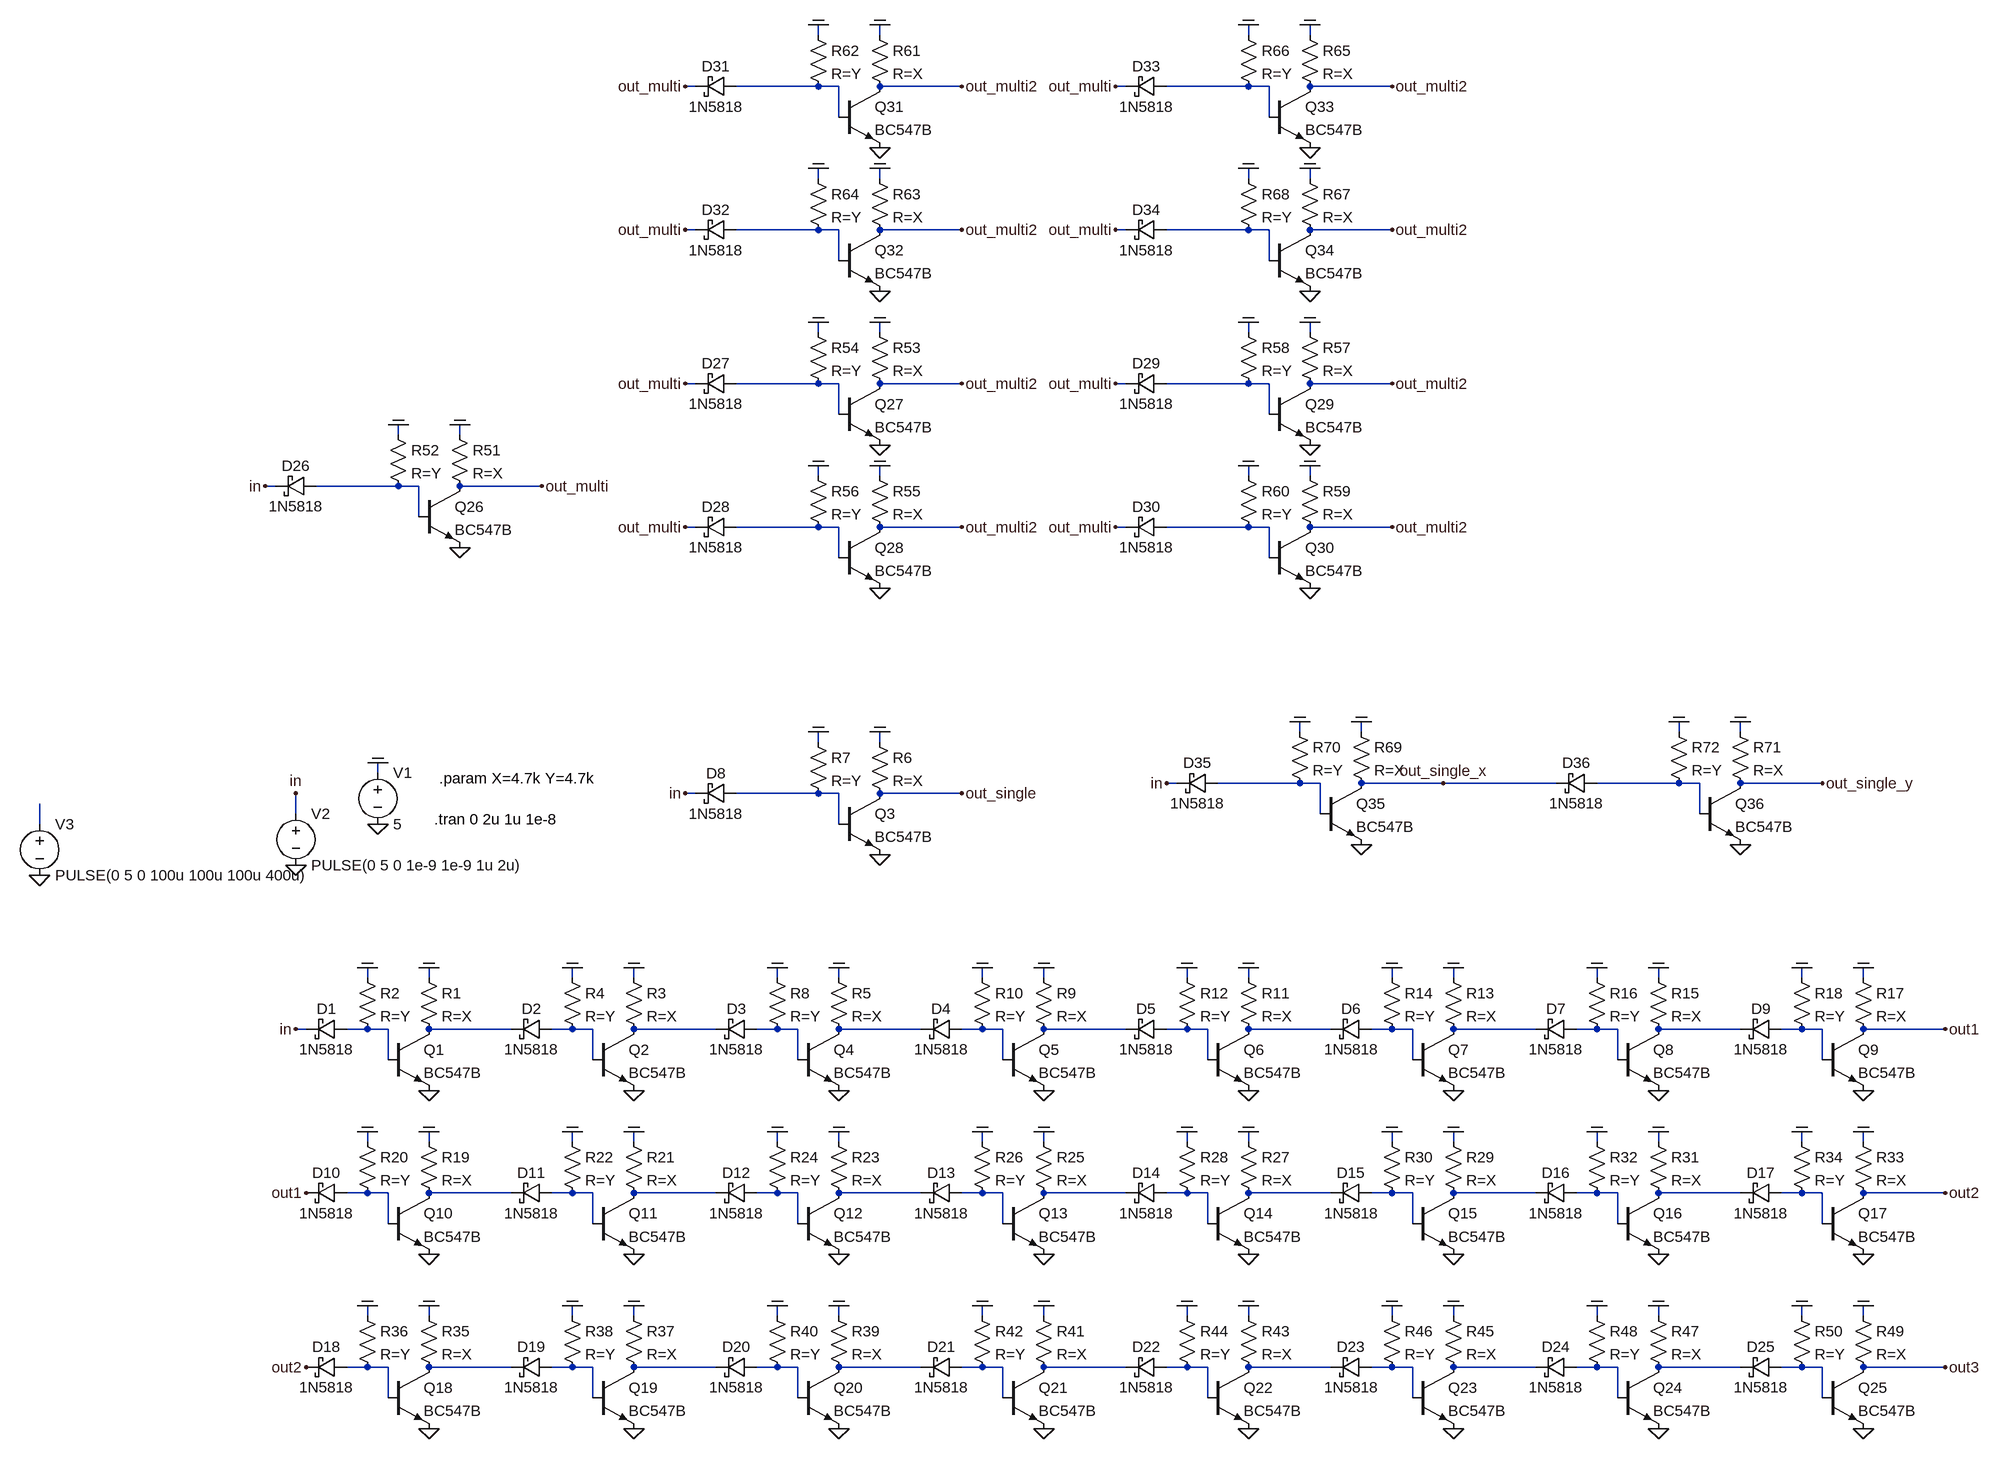
[diagram p0: schematic dtl_schottky.asc]
dtl_schottky.asc, the LTspice schematic file:
Version 4
SHEET 1 2948 1332
WIRE 576 -864 576 -880
WIRE 672 -864 672 -880
WIRE 1248 -864 1248 -880
WIRE 1344 -864 1344 -880
WIRE 384 -784 368 -784
WIRE 576 -784 448 -784
WIRE 608 -784 576 -784
WIRE 800 -784 672 -784
WIRE 1056 -784 1040 -784
WIRE 1248 -784 1120 -784
WIRE 1280 -784 1248 -784
WIRE 1472 -784 1344 -784
WIRE 608 -736 608 -784
WIRE 1280 -736 1280 -784
WIRE 576 -640 576 -656
WIRE 672 -640 672 -656
WIRE 1248 -640 1248 -656
WIRE 1344 -640 1344 -656
WIRE 384 -560 368 -560
WIRE 576 -560 448 -560
WIRE 608 -560 576 -560
WIRE 800 -560 672 -560
WIRE 1056 -560 1040 -560
WIRE 1248 -560 1120 -560
WIRE 1280 -560 1248 -560
WIRE 1472 -560 1344 -560
WIRE 608 -512 608 -560
WIRE 1280 -512 1280 -560
WIRE 576 -400 576 -416
WIRE 672 -400 672 -416
WIRE 1248 -400 1248 -416
WIRE 1344 -400 1344 -416
WIRE 384 -320 368 -320
WIRE 576 -320 448 -320
WIRE 608 -320 576 -320
WIRE 800 -320 672 -320
WIRE 1056 -320 1040 -320
WIRE 1248 -320 1120 -320
WIRE 1280 -320 1248 -320
WIRE 1472 -320 1344 -320
WIRE 608 -272 608 -320
WIRE 1280 -272 1280 -320
WIRE -80 -240 -80 -256
WIRE 16 -240 16 -256
WIRE 576 -176 576 -192
WIRE 672 -176 672 -192
WIRE 1248 -176 1248 -192
WIRE 1344 -176 1344 -192
WIRE -272 -160 -288 -160
WIRE -80 -160 -208 -160
WIRE -48 -160 -80 -160
WIRE 144 -160 16 -160
WIRE -48 -112 -48 -160
WIRE 384 -96 368 -96
WIRE 576 -96 448 -96
WIRE 608 -96 576 -96
WIRE 800 -96 672 -96
WIRE 1056 -96 1040 -96
WIRE 1248 -96 1120 -96
WIRE 1280 -96 1248 -96
WIRE 1472 -96 1344 -96
WIRE 608 -48 608 -96
WIRE 1280 -48 1280 -96
WIRE 1328 224 1328 208
WIRE 1424 224 1424 208
WIRE 1920 224 1920 208
WIRE 2016 224 2016 208
WIRE 576 240 576 224
WIRE 672 240 672 224
WIRE -112 288 -112 272
WIRE 1136 304 1120 304
WIRE 1328 304 1200 304
WIRE 1360 304 1328 304
WIRE 1552 304 1424 304
WIRE 1728 304 1552 304
WIRE 1920 304 1792 304
WIRE 1952 304 1920 304
WIRE 2144 304 2016 304
WIRE 384 320 368 320
WIRE 576 320 448 320
WIRE 608 320 576 320
WIRE 800 320 672 320
WIRE -240 352 -240 320
WIRE 1360 352 1360 304
WIRE 1952 352 1952 304
WIRE -640 368 -640 336
WIRE 608 368 608 320
WIRE -128 608 -128 592
WIRE -32 608 -32 592
WIRE 192 608 192 592
WIRE 288 608 288 592
WIRE 512 608 512 592
WIRE 608 608 608 592
WIRE 832 608 832 592
WIRE 928 608 928 592
WIRE 1152 608 1152 592
WIRE 1248 608 1248 592
WIRE 1472 608 1472 592
WIRE 1568 608 1568 592
WIRE 1792 608 1792 592
WIRE 1888 608 1888 592
WIRE 2112 608 2112 592
WIRE 2208 608 2208 592
WIRE -224 688 -240 688
WIRE -128 688 -160 688
WIRE -96 688 -128 688
WIRE 96 688 -32 688
WIRE 192 688 160 688
WIRE 224 688 192 688
WIRE 416 688 288 688
WIRE 512 688 480 688
WIRE 544 688 512 688
WIRE 736 688 608 688
WIRE 832 688 800 688
WIRE 864 688 832 688
WIRE 1056 688 928 688
WIRE 1152 688 1120 688
WIRE 1184 688 1152 688
WIRE 1376 688 1248 688
WIRE 1472 688 1440 688
WIRE 1504 688 1472 688
WIRE 1696 688 1568 688
WIRE 1792 688 1760 688
WIRE 1824 688 1792 688
WIRE 2016 688 1888 688
WIRE 2112 688 2080 688
WIRE 2144 688 2112 688
WIRE 2336 688 2208 688
WIRE -96 736 -96 688
WIRE 224 736 224 688
WIRE 544 736 544 688
WIRE 864 736 864 688
WIRE 1184 736 1184 688
WIRE 1504 736 1504 688
WIRE 1824 736 1824 688
WIRE 2144 736 2144 688
WIRE -128 864 -128 848
WIRE -32 864 -32 848
WIRE 192 864 192 848
WIRE 288 864 288 848
WIRE 512 864 512 848
WIRE 608 864 608 848
WIRE 832 864 832 848
WIRE 928 864 928 848
WIRE 1152 864 1152 848
WIRE 1248 864 1248 848
WIRE 1472 864 1472 848
WIRE 1568 864 1568 848
WIRE 1792 864 1792 848
WIRE 1888 864 1888 848
WIRE 2112 864 2112 848
WIRE 2208 864 2208 848
WIRE -128 944 -160 944
WIRE -96 944 -128 944
WIRE 96 944 -32 944
WIRE 192 944 160 944
WIRE 224 944 192 944
WIRE 416 944 288 944
WIRE 512 944 480 944
WIRE 544 944 512 944
WIRE 736 944 608 944
WIRE 832 944 800 944
WIRE 864 944 832 944
WIRE 1056 944 928 944
WIRE 1152 944 1120 944
WIRE 1184 944 1152 944
WIRE 1376 944 1248 944
WIRE 1472 944 1440 944
WIRE 1504 944 1472 944
WIRE 1696 944 1568 944
WIRE 1792 944 1760 944
WIRE 1824 944 1792 944
WIRE 2016 944 1888 944
WIRE 2112 944 2080 944
WIRE 2144 944 2112 944
WIRE 2336 944 2208 944
WIRE -96 992 -96 944
WIRE 224 992 224 944
WIRE 544 992 544 944
WIRE 864 992 864 944
WIRE 1184 992 1184 944
WIRE 1504 992 1504 944
WIRE 1824 992 1824 944
WIRE 2144 992 2144 944
WIRE -128 1136 -128 1120
WIRE -32 1136 -32 1120
WIRE 192 1136 192 1120
WIRE 288 1136 288 1120
WIRE 512 1136 512 1120
WIRE 608 1136 608 1120
WIRE 832 1136 832 1120
WIRE 928 1136 928 1120
WIRE 1152 1136 1152 1120
WIRE 1248 1136 1248 1120
WIRE 1472 1136 1472 1120
WIRE 1568 1136 1568 1120
WIRE 1792 1136 1792 1120
WIRE 1888 1136 1888 1120
WIRE 2112 1136 2112 1120
WIRE 2208 1136 2208 1120
WIRE -128 1216 -160 1216
WIRE -96 1216 -128 1216
WIRE 96 1216 -32 1216
WIRE 192 1216 160 1216
WIRE 224 1216 192 1216
WIRE 416 1216 288 1216
WIRE 512 1216 480 1216
WIRE 544 1216 512 1216
WIRE 736 1216 608 1216
WIRE 832 1216 800 1216
WIRE 864 1216 832 1216
WIRE 1056 1216 928 1216
WIRE 1152 1216 1120 1216
WIRE 1184 1216 1152 1216
WIRE 1376 1216 1248 1216
WIRE 1472 1216 1440 1216
WIRE 1504 1216 1472 1216
WIRE 1696 1216 1568 1216
WIRE 1792 1216 1760 1216
WIRE 1824 1216 1792 1216
WIRE 2016 1216 1888 1216
WIRE 2112 1216 2080 1216
WIRE 2144 1216 2112 1216
WIRE 2336 1216 2208 1216
WIRE -96 1264 -96 1216
WIRE 224 1264 224 1216
WIRE 544 1264 544 1216
WIRE 864 1264 864 1216
WIRE 1184 1264 1184 1216
WIRE 1504 1264 1504 1216
WIRE 1824 1264 1824 1216
WIRE 2144 1264 2144 1216
FLAG -112 368 0
FLAG -112 272 COM
FLAG -240 432 0
FLAG 672 416 0
FLAG 672 224 COM
FLAG 576 224 COM
FLAG 368 320 in
FLAG 800 320 out_single
FLAG -32 784 0
FLAG -32 592 COM
FLAG -128 592 COM
FLAG -240 688 in
FLAG 288 784 0
FLAG 288 592 COM
FLAG 192 592 COM
FLAG 608 784 0
FLAG 608 592 COM
FLAG 512 592 COM
FLAG 928 784 0
FLAG 928 592 COM
FLAG 832 592 COM
FLAG 1248 784 0
FLAG 1248 592 COM
FLAG 1152 592 COM
FLAG 1568 784 0
FLAG 1568 592 COM
FLAG 1472 592 COM
FLAG 1888 784 0
FLAG 1888 592 COM
FLAG 1792 592 COM
FLAG 2208 784 0
FLAG 2208 592 COM
FLAG 2112 592 COM
FLAG -32 1040 0
FLAG -32 848 COM
FLAG -128 848 COM
FLAG 288 1040 0
FLAG 288 848 COM
FLAG 192 848 COM
FLAG 608 1040 0
FLAG 608 848 COM
FLAG 512 848 COM
FLAG 928 1040 0
FLAG 928 848 COM
FLAG 832 848 COM
FLAG 1248 1040 0
FLAG 1248 848 COM
FLAG 1152 848 COM
FLAG 1568 1040 0
FLAG 1568 848 COM
FLAG 1472 848 COM
FLAG 1888 1040 0
FLAG 1888 848 COM
FLAG 1792 848 COM
FLAG 2208 1040 0
FLAG 2208 848 COM
FLAG 2112 848 COM
FLAG -32 1312 0
FLAG -32 1120 COM
FLAG -128 1120 COM
FLAG 288 1312 0
FLAG 288 1120 COM
FLAG 192 1120 COM
FLAG 608 1312 0
FLAG 608 1120 COM
FLAG 512 1120 COM
FLAG 928 1312 0
FLAG 928 1120 COM
FLAG 832 1120 COM
FLAG 1248 1312 0
FLAG 1248 1120 COM
FLAG 1152 1120 COM
FLAG 1568 1312 0
FLAG 1568 1120 COM
FLAG 1472 1120 COM
FLAG 1888 1312 0
FLAG 1888 1120 COM
FLAG 1792 1120 COM
FLAG 2208 1312 0
FLAG 2208 1120 COM
FLAG 2112 1120 COM
FLAG 2336 688 out1
FLAG -224 944 out1
FLAG 2336 944 out2
FLAG -224 1216 out2
FLAG 2336 1216 out3
FLAG 16 -64 0
FLAG 16 -256 COM
FLAG -80 -256 COM
FLAG -288 -160 in
FLAG 144 -160 out_multi
FLAG 672 -224 0
FLAG 672 -416 COM
FLAG 576 -416 COM
FLAG 368 -320 out_multi
FLAG 800 -320 out_multi2
FLAG 672 0 0
FLAG 672 -192 COM
FLAG 576 -192 COM
FLAG 368 -96 out_multi
FLAG 800 -96 out_multi2
FLAG 1344 -224 0
FLAG 1344 -416 COM
FLAG 1248 -416 COM
FLAG 1040 -320 out_multi
FLAG 1472 -320 out_multi2
FLAG 1344 0 0
FLAG 1344 -192 COM
FLAG 1248 -192 COM
FLAG 1040 -96 out_multi
FLAG 1472 -96 out_multi2
FLAG 672 -688 0
FLAG 672 -880 COM
FLAG 576 -880 COM
FLAG 368 -784 out_multi
FLAG 800 -784 out_multi2
FLAG 672 -464 0
FLAG 672 -656 COM
FLAG 576 -656 COM
FLAG 368 -560 out_multi
FLAG 800 -560 out_multi2
FLAG 1344 -688 0
FLAG 1344 -880 COM
FLAG 1248 -880 COM
FLAG 1040 -784 out_multi
FLAG 1472 -784 out_multi2
FLAG 1344 -464 0
FLAG 1344 -656 COM
FLAG 1248 -656 COM
FLAG 1040 -560 out_multi
FLAG 1472 -560 out_multi2
FLAG 1424 400 0
FLAG 1424 208 COM
FLAG 1328 208 COM
FLAG 1120 304 in
FLAG 2016 400 0
FLAG 2016 208 COM
FLAG 1920 208 COM
FLAG 1552 304 out_single_x
FLAG 2144 304 out_single_y
FLAG -640 448 0
FLAG -240 320 in
SYMBOL voltage -112 272 R0
WINDOW 123 0 0 Left 2
WINDOW 39 0 0 Left 2
SYMATTR InstName V1
SYMATTR Value 5
SYMBOL voltage -240 336 R0
WINDOW 123 0 0 Left 2
WINDOW 39 0 0 Left 2
SYMATTR InstName V2
SYMATTR Value PULSE(0 5 0 1e-9 1e-9 1u 2u)
SYMBOL npn 608 320 R0
SYMATTR InstName Q3
SYMATTR Value BC547B
SYMBOL res 656 224 R0
SYMATTR InstName R6
SYMATTR Value R=X
SYMBOL schottky 448 304 R90
WINDOW 0 0 32 VBottom 2
WINDOW 3 32 32 VTop 2
SYMATTR InstName D8
SYMATTR Value 1N5818
SYMATTR Description Diode
SYMATTR Type diode
SYMBOL res 560 224 R0
SYMATTR InstName R7
SYMATTR Value R=Y
SYMBOL npn -96 688 R0
SYMATTR InstName Q1
SYMATTR Value BC547B
SYMBOL res -48 592 R0
SYMATTR InstName R1
SYMATTR Value R=X
SYMBOL schottky -160 672 R90
WINDOW 0 0 32 VBottom 2
WINDOW 3 32 32 VTop 2
SYMATTR InstName D1
SYMATTR Value 1N5818
SYMATTR Description Diode
SYMATTR Type diode
SYMBOL res -144 592 R0
SYMATTR InstName R2
SYMATTR Value R=Y
SYMBOL npn 224 688 R0
SYMATTR InstName Q2
SYMATTR Value BC547B
SYMBOL res 272 592 R0
SYMATTR InstName R3
SYMATTR Value R=X
SYMBOL schottky 160 672 R90
WINDOW 0 0 32 VBottom 2
WINDOW 3 32 32 VTop 2
SYMATTR InstName D2
SYMATTR Value 1N5818
SYMATTR Description Diode
SYMATTR Type diode
SYMBOL res 176 592 R0
SYMATTR InstName R4
SYMATTR Value R=Y
SYMBOL npn 544 688 R0
SYMATTR InstName Q4
SYMATTR Value BC547B
SYMBOL res 592 592 R0
SYMATTR InstName R5
SYMATTR Value R=X
SYMBOL schottky 480 672 R90
WINDOW 0 0 32 VBottom 2
WINDOW 3 32 32 VTop 2
SYMATTR InstName D3
SYMATTR Value 1N5818
SYMATTR Description Diode
SYMATTR Type diode
SYMBOL res 496 592 R0
SYMATTR InstName R8
SYMATTR Value R=Y
SYMBOL npn 864 688 R0
SYMATTR InstName Q5
SYMATTR Value BC547B
SYMBOL res 912 592 R0
SYMATTR InstName R9
SYMATTR Value R=X
SYMBOL schottky 800 672 R90
WINDOW 0 0 32 VBottom 2
WINDOW 3 32 32 VTop 2
SYMATTR InstName D4
SYMATTR Value 1N5818
SYMATTR Description Diode
SYMATTR Type diode
SYMBOL res 816 592 R0
SYMATTR InstName R10
SYMATTR Value R=Y
SYMBOL npn 1184 688 R0
SYMATTR InstName Q6
SYMATTR Value BC547B
SYMBOL res 1232 592 R0
SYMATTR InstName R11
SYMATTR Value R=X
SYMBOL schottky 1120 672 R90
WINDOW 0 0 32 VBottom 2
WINDOW 3 32 32 VTop 2
SYMATTR InstName D5
SYMATTR Value 1N5818
SYMATTR Description Diode
SYMATTR Type diode
SYMBOL res 1136 592 R0
SYMATTR InstName R12
SYMATTR Value R=Y
SYMBOL npn 1504 688 R0
SYMATTR InstName Q7
SYMATTR Value BC547B
SYMBOL res 1552 592 R0
SYMATTR InstName R13
SYMATTR Value R=X
SYMBOL schottky 1440 672 R90
WINDOW 0 0 32 VBottom 2
WINDOW 3 32 32 VTop 2
SYMATTR InstName D6
SYMATTR Value 1N5818
SYMATTR Description Diode
SYMATTR Type diode
SYMBOL res 1456 592 R0
SYMATTR InstName R14
SYMATTR Value R=Y
SYMBOL npn 1824 688 R0
SYMATTR InstName Q8
SYMATTR Value BC547B
SYMBOL res 1872 592 R0
SYMATTR InstName R15
SYMATTR Value R=X
SYMBOL schottky 1760 672 R90
WINDOW 0 0 32 VBottom 2
WINDOW 3 32 32 VTop 2
SYMATTR InstName D7
SYMATTR Value 1N5818
SYMATTR Description Diode
SYMATTR Type diode
SYMBOL res 1776 592 R0
SYMATTR InstName R16
SYMATTR Value R=Y
SYMBOL npn 2144 688 R0
SYMATTR InstName Q9
SYMATTR Value BC547B
SYMBOL res 2192 592 R0
SYMATTR InstName R17
SYMATTR Value R=X
SYMBOL schottky 2080 672 R90
WINDOW 0 0 32 VBottom 2
WINDOW 3 32 32 VTop 2
SYMATTR InstName D9
SYMATTR Value 1N5818
SYMATTR Description Diode
SYMATTR Type diode
SYMBOL res 2096 592 R0
SYMATTR InstName R18
SYMATTR Value R=Y
SYMBOL npn -96 944 R0
SYMATTR InstName Q10
SYMATTR Value BC547B
SYMBOL res -48 848 R0
SYMATTR InstName R19
SYMATTR Value R=X
SYMBOL schottky -160 928 R90
WINDOW 0 0 32 VBottom 2
WINDOW 3 32 32 VTop 2
SYMATTR InstName D10
SYMATTR Value 1N5818
SYMATTR Description Diode
SYMATTR Type diode
SYMBOL res -144 848 R0
SYMATTR InstName R20
SYMATTR Value R=Y
SYMBOL npn 224 944 R0
SYMATTR InstName Q11
SYMATTR Value BC547B
SYMBOL res 272 848 R0
SYMATTR InstName R21
SYMATTR Value R=X
SYMBOL schottky 160 928 R90
WINDOW 0 0 32 VBottom 2
WINDOW 3 32 32 VTop 2
SYMATTR InstName D11
SYMATTR Value 1N5818
SYMATTR Description Diode
SYMATTR Type diode
SYMBOL res 176 848 R0
SYMATTR InstName R22
SYMATTR Value R=Y
SYMBOL npn 544 944 R0
SYMATTR InstName Q12
SYMATTR Value BC547B
SYMBOL res 592 848 R0
SYMATTR InstName R23
SYMATTR Value R=X
SYMBOL schottky 480 928 R90
WINDOW 0 0 32 VBottom 2
WINDOW 3 32 32 VTop 2
SYMATTR InstName D12
SYMATTR Value 1N5818
SYMATTR Description Diode
SYMATTR Type diode
SYMBOL res 496 848 R0
SYMATTR InstName R24
SYMATTR Value R=Y
SYMBOL npn 864 944 R0
SYMATTR InstName Q13
SYMATTR Value BC547B
SYMBOL res 912 848 R0
SYMATTR InstName R25
SYMATTR Value R=X
SYMBOL schottky 800 928 R90
WINDOW 0 0 32 VBottom 2
WINDOW 3 32 32 VTop 2
SYMATTR InstName D13
SYMATTR Value 1N5818
SYMATTR Description Diode
SYMATTR Type diode
SYMBOL res 816 848 R0
SYMATTR InstName R26
SYMATTR Value R=Y
SYMBOL npn 1184 944 R0
SYMATTR InstName Q14
SYMATTR Value BC547B
SYMBOL res 1232 848 R0
SYMATTR InstName R27
SYMATTR Value R=X
SYMBOL schottky 1120 928 R90
WINDOW 0 0 32 VBottom 2
WINDOW 3 32 32 VTop 2
SYMATTR InstName D14
SYMATTR Value 1N5818
SYMATTR Description Diode
SYMATTR Type diode
SYMBOL res 1136 848 R0
SYMATTR InstName R28
SYMATTR Value R=Y
SYMBOL npn 1504 944 R0
SYMATTR InstName Q15
SYMATTR Value BC547B
SYMBOL res 1552 848 R0
SYMATTR InstName R29
SYMATTR Value R=X
SYMBOL schottky 1440 928 R90
WINDOW 0 0 32 VBottom 2
WINDOW 3 32 32 VTop 2
SYMATTR InstName D15
SYMATTR Value 1N5818
SYMATTR Description Diode
SYMATTR Type diode
SYMBOL res 1456 848 R0
SYMATTR InstName R30
SYMATTR Value R=Y
SYMBOL npn 1824 944 R0
SYMATTR InstName Q16
SYMATTR Value BC547B
SYMBOL res 1872 848 R0
SYMATTR InstName R31
SYMATTR Value R=X
SYMBOL schottky 1760 928 R90
WINDOW 0 0 32 VBottom 2
WINDOW 3 32 32 VTop 2
SYMATTR InstName D16
SYMATTR Value 1N5818
SYMATTR Description Diode
SYMATTR Type diode
SYMBOL res 1776 848 R0
SYMATTR InstName R32
SYMATTR Value R=Y
SYMBOL npn 2144 944 R0
SYMATTR InstName Q17
SYMATTR Value BC547B
SYMBOL res 2192 848 R0
SYMATTR InstName R33
SYMATTR Value R=X
SYMBOL schottky 2080 928 R90
WINDOW 0 0 32 VBottom 2
WINDOW 3 32 32 VTop 2
SYMATTR InstName D17
SYMATTR Value 1N5818
SYMATTR Description Diode
SYMATTR Type diode
SYMBOL res 2096 848 R0
SYMATTR InstName R34
SYMATTR Value R=Y
SYMBOL npn -96 1216 R0
SYMATTR InstName Q18
SYMATTR Value BC547B
SYMBOL res -48 1120 R0
SYMATTR InstName R35
SYMATTR Value R=X
SYMBOL schottky -160 1200 R90
WINDOW 0 0 32 VBottom 2
WINDOW 3 32 32 VTop 2
SYMATTR InstName D18
SYMATTR Value 1N5818
SYMATTR Description Diode
SYMATTR Type diode
SYMBOL res -144 1120 R0
SYMATTR InstName R36
SYMATTR Value R=Y
SYMBOL npn 224 1216 R0
SYMATTR InstName Q19
SYMATTR Value BC547B
SYMBOL res 272 1120 R0
SYMATTR InstName R37
SYMATTR Value R=X
SYMBOL schottky 160 1200 R90
WINDOW 0 0 32 VBottom 2
WINDOW 3 32 32 VTop 2
SYMATTR InstName D19
SYMATTR Value 1N5818
SYMATTR Description Diode
SYMATTR Type diode
SYMBOL res 176 1120 R0
SYMATTR InstName R38
SYMATTR Value R=Y
SYMBOL npn 544 1216 R0
SYMATTR InstName Q20
SYMATTR Value BC547B
SYMBOL res 592 1120 R0
SYMATTR InstName R39
SYMATTR Value R=X
SYMBOL schottky 480 1200 R90
WINDOW 0 0 32 VBottom 2
WINDOW 3 32 32 VTop 2
SYMATTR InstName D20
SYMATTR Value 1N5818
SYMATTR Description Diode
SYMATTR Type diode
SYMBOL res 496 1120 R0
SYMATTR InstName R40
SYMATTR Value R=Y
SYMBOL npn 864 1216 R0
SYMATTR InstName Q21
SYMATTR Value BC547B
SYMBOL res 912 1120 R0
SYMATTR InstName R41
SYMATTR Value R=X
SYMBOL schottky 800 1200 R90
WINDOW 0 0 32 VBottom 2
WINDOW 3 32 32 VTop 2
SYMATTR InstName D21
SYMATTR Value 1N5818
SYMATTR Description Diode
SYMATTR Type diode
SYMBOL res 816 1120 R0
SYMATTR InstName R42
SYMATTR Value R=Y
SYMBOL npn 1184 1216 R0
SYMATTR InstName Q22
SYMATTR Value BC547B
SYMBOL res 1232 1120 R0
SYMATTR InstName R43
SYMATTR Value R=X
SYMBOL schottky 1120 1200 R90
WINDOW 0 0 32 VBottom 2
WINDOW 3 32 32 VTop 2
SYMATTR InstName D22
SYMATTR Value 1N5818
SYMATTR Description Diode
SYMATTR Type diode
SYMBOL res 1136 1120 R0
SYMATTR InstName R44
SYMATTR Value R=Y
SYMBOL npn 1504 1216 R0
SYMATTR InstName Q23
SYMATTR Value BC547B
SYMBOL res 1552 1120 R0
SYMATTR InstName R45
SYMATTR Value R=X
SYMBOL schottky 1440 1200 R90
WINDOW 0 0 32 VBottom 2
WINDOW 3 32 32 VTop 2
SYMATTR InstName D23
SYMATTR Value 1N5818
SYMATTR Description Diode
SYMATTR Type diode
SYMBOL res 1456 1120 R0
SYMATTR InstName R46
SYMATTR Value R=Y
SYMBOL npn 1824 1216 R0
SYMATTR InstName Q24
SYMATTR Value BC547B
SYMBOL res 1872 1120 R0
SYMATTR InstName R47
SYMATTR Value R=X
SYMBOL schottky 1760 1200 R90
WINDOW 0 0 32 VBottom 2
WINDOW 3 32 32 VTop 2
SYMATTR InstName D24
SYMATTR Value 1N5818
SYMATTR Description Diode
SYMATTR Type diode
SYMBOL res 1776 1120 R0
SYMATTR InstName R48
SYMATTR Value R=Y
SYMBOL npn 2144 1216 R0
SYMATTR InstName Q25
SYMATTR Value BC547B
SYMBOL res 2192 1120 R0
SYMATTR InstName R49
SYMATTR Value R=X
SYMBOL schottky 2080 1200 R90
WINDOW 0 0 32 VBottom 2
WINDOW 3 32 32 VTop 2
SYMATTR InstName D25
SYMATTR Value 1N5818
SYMATTR Description Diode
SYMATTR Type diode
SYMBOL res 2096 1120 R0
SYMATTR InstName R50
SYMATTR Value R=Y
SYMBOL npn -48 -160 R0
SYMATTR InstName Q26
SYMATTR Value BC547B
SYMBOL res 0 -256 R0
SYMATTR InstName R51
SYMATTR Value R=X
SYMBOL schottky -208 -176 R90
WINDOW 0 0 32 VBottom 2
WINDOW 3 32 32 VTop 2
SYMATTR InstName D26
SYMATTR Value 1N5818
SYMATTR Description Diode
SYMATTR Type diode
SYMBOL res -96 -256 R0
SYMATTR InstName R52
SYMATTR Value R=Y
SYMBOL npn 608 -320 R0
SYMATTR InstName Q27
SYMATTR Value BC547B
SYMBOL res 656 -416 R0
SYMATTR InstName R53
SYMATTR Value R=X
SYMBOL schottky 448 -336 R90
WINDOW 0 0 32 VBottom 2
WINDOW 3 32 32 VTop 2
SYMATTR InstName D27
SYMATTR Value 1N5818
SYMATTR Description Diode
SYMATTR Type diode
SYMBOL res 560 -416 R0
SYMATTR InstName R54
SYMATTR Value R=Y
SYMBOL npn 608 -96 R0
SYMATTR InstName Q28
SYMATTR Value BC547B
SYMBOL res 656 -192 R0
SYMATTR InstName R55
SYMATTR Value R=X
SYMBOL schottky 448 -112 R90
WINDOW 0 0 32 VBottom 2
WINDOW 3 32 32 VTop 2
SYMATTR InstName D28
SYMATTR Value 1N5818
SYMATTR Description Diode
SYMATTR Type diode
SYMBOL res 560 -192 R0
SYMATTR InstName R56
SYMATTR Value R=Y
SYMBOL npn 1280 -320 R0
SYMATTR InstName Q29
SYMATTR Value BC547B
SYMBOL res 1328 -416 R0
SYMATTR InstName R57
SYMATTR Value R=X
SYMBOL schottky 1120 -336 R90
WINDOW 0 0 32 VBottom 2
WINDOW 3 32 32 VTop 2
SYMATTR InstName D29
SYMATTR Value 1N5818
SYMATTR Description Diode
SYMATTR Type diode
SYMBOL res 1232 -416 R0
SYMATTR InstName R58
SYMATTR Value R=Y
SYMBOL npn 1280 -96 R0
SYMATTR InstName Q30
SYMATTR Value BC547B
SYMBOL res 1328 -192 R0
SYMATTR InstName R59
SYMATTR Value R=X
SYMBOL schottky 1120 -112 R90
WINDOW 0 0 32 VBottom 2
WINDOW 3 32 32 VTop 2
SYMATTR InstName D30
SYMATTR Value 1N5818
SYMATTR Description Diode
SYMATTR Type diode
SYMBOL res 1232 -192 R0
SYMATTR InstName R60
SYMATTR Value R=Y
SYMBOL npn 608 -784 R0
SYMATTR InstName Q31
SYMATTR Value BC547B
SYMBOL res 656 -880 R0
SYMATTR InstName R61
SYMATTR Value R=X
SYMBOL schottky 448 -800 R90
WINDOW 0 0 32 VBottom 2
WINDOW 3 32 32 VTop 2
SYMATTR InstName D31
SYMATTR Value 1N5818
SYMATTR Description Diode
SYMATTR Type diode
SYMBOL res 560 -880 R0
SYMATTR InstName R62
SYMATTR Value R=Y
SYMBOL npn 608 -560 R0
SYMATTR InstName Q32
SYMATTR Value BC547B
SYMBOL res 656 -656 R0
SYMATTR InstName R63
SYMATTR Value R=X
SYMBOL schottky 448 -576 R90
WINDOW 0 0 32 VBottom 2
WINDOW 3 32 32 VTop 2
SYMATTR InstName D32
SYMATTR Value 1N5818
SYMATTR Description Diode
SYMATTR Type diode
SYMBOL res 560 -656 R0
SYMATTR InstName R64
SYMATTR Value R=Y
SYMBOL npn 1280 -784 R0
SYMATTR InstName Q33
SYMATTR Value BC547B
SYMBOL res 1328 -880 R0
SYMATTR InstName R65
SYMATTR Value R=X
SYMBOL schottky 1120 -800 R90
WINDOW 0 0 32 VBottom 2
WINDOW 3 32 32 VTop 2
SYMATTR InstName D33
SYMATTR Value 1N5818
SYMATTR Description Diode
SYMATTR Type diode
SYMBOL res 1232 -880 R0
SYMATTR InstName R66
SYMATTR Value R=Y
SYMBOL npn 1280 -560 R0
SYMATTR InstName Q34
SYMATTR Value BC547B
SYMBOL res 1328 -656 R0
SYMATTR InstName R67
SYMATTR Value R=X
SYMBOL schottky 1120 -576 R90
WINDOW 0 0 32 VBottom 2
WINDOW 3 32 32 VTop 2
SYMATTR InstName D34
SYMATTR Value 1N5818
SYMATTR Description Diode
SYMATTR Type diode
SYMBOL res 1232 -656 R0
SYMATTR InstName R68
SYMATTR Value R=Y
SYMBOL npn 1360 304 R0
SYMATTR InstName Q35
SYMATTR Value BC547B
SYMBOL res 1408 208 R0
SYMATTR InstName R69
SYMATTR Value R=X
SYMBOL schottky 1200 288 R90
WINDOW 0 0 32 VBottom 2
WINDOW 3 32 32 VTop 2
SYMATTR InstName D35
SYMATTR Value 1N5818
SYMATTR Description Diode
SYMATTR Type diode
SYMBOL res 1312 208 R0
SYMATTR InstName R70
SYMATTR Value R=Y
SYMBOL npn 1952 304 R0
SYMATTR InstName Q36
SYMATTR Value BC547B
SYMBOL res 2000 208 R0
SYMATTR InstName R71
SYMATTR Value R=X
SYMBOL schottky 1792 288 R90
WINDOW 0 0 32 VBottom 2
WINDOW 3 32 32 VTop 2
SYMATTR InstName D36
SYMATTR Value 1N5818
SYMATTR Description Diode
SYMATTR Type diode
SYMBOL res 1904 208 R0
SYMATTR InstName R72
SYMATTR Value R=Y
SYMBOL voltage -640 352 R0
WINDOW 123 0 0 Left 2
WINDOW 39 0 0 Left 2
SYMATTR InstName V3
SYMATTR Value PULSE(0 5 0 100u 100u 100u 400u)
TEXT -24 360 Left 2 !.tran 0 2u 1u 1e-8
TEXT -16 296 Left 2 !.param X=4.7k Y=4.7k

The netlist it stands for:
* dtl_schottky.asc
V1 COM 0 5
V2 in 0 PULSE(0 5 0 1e-9 1e-9 1u 2u)
Q3 out_single N012 0 0 BC547B
R6 COM out_single R=X
D8 N012 in 1N5818
R7 COM N012 R=Y
Q1 N015 N014 0 0 BC547B
R1 COM N015 R=X
D1 N014 in 1N5818
R2 COM N014 R=Y
Q2 N017 N016 0 0 BC547B
R3 COM N017 R=X
D2 N016 N015 1N5818
R4 COM N016 R=Y
Q4 N019 N018 0 0 BC547B
R5 COM N019 R=X
D3 N018 N017 1N5818
R8 COM N018 R=Y
Q5 N021 N020 0 0 BC547B
R9 COM N021 R=X
D4 N020 N019 1N5818
R10 COM N020 R=Y
Q6 N023 N022 0 0 BC547B
R11 COM N023 R=X
D5 N022 N021 1N5818
R12 COM N022 R=Y
Q7 N025 N024 0 0 BC547B
R13 COM N025 R=X
D6 N024 N023 1N5818
R14 COM N024 R=Y
Q8 N027 N026 0 0 BC547B
R15 COM N027 R=X
D7 N026 N025 1N5818
R16 COM N026 R=Y
Q9 out1 N028 0 0 BC547B
R17 COM out1 R=X
D9 N028 N027 1N5818
R18 COM N028 R=Y
Q10 N030 N029 0 0 BC547B
R19 COM N030 R=X
D10 N029 out1 1N5818
R20 COM N029 R=Y
Q11 N032 N031 0 0 BC547B
R21 COM N032 R=X
D11 N031 N030 1N5818
R22 COM N031 R=Y
Q12 N034 N033 0 0 BC547B
R23 COM N034 R=X
D12 N033 N032 1N5818
R24 COM N033 R=Y
Q13 N036 N035 0 0 BC547B
R25 COM N036 R=X
D13 N035 N034 1N5818
R26 COM N035 R=Y
Q14 N038 N037 0 0 BC547B
R27 COM N038 R=X
D14 N037 N036 1N5818
R28 COM N037 R=Y
Q15 N040 N039 0 0 BC547B
R29 COM N040 R=X
D15 N039 N038 1N5818
R30 COM N039 R=Y
Q16 N042 N041 0 0 BC547B
R31 COM N042 R=X
D16 N041 N040 1N5818
R32 COM N041 R=Y
Q17 out2 N043 0 0 BC547B
R33 COM out2 R=X
D17 N043 N042 1N5818
R34 COM N043 R=Y
Q18 N045 N044 0 0 BC547B
R35 COM N045 R=X
D18 N044 out2 1N5818
R36 COM N044 R=Y
Q19 N047 N046 0 0 BC547B
R37 COM N047 R=X
D19 N046 N045 1N5818
R38 COM N046 R=Y
Q20 N049 N048 0 0 BC547B
R39 COM N049 R=X
D20 N048 N047 1N5818
R40 COM N048 R=Y
Q21 N051 N050 0 0 BC547B
R41 COM N051 R=X
D21 N050 N049 1N5818
R42 COM N050 R=Y
Q22 N053 N052 0 0 BC547B
R43 COM N053 R=X
D22 N052 N051 1N5818
R44 COM N052 R=Y
Q23 N055 N054 0 0 BC547B
R45 COM N055 R=X
D23 N054 N053 1N5818
R46 COM N054 R=Y
Q24 N057 N056 0 0 BC547B
R47 COM N057 R=X
D24 N056 N055 1N5818
R48 COM N056 R=Y
Q25 out3 N058 0 0 BC547B
R49 COM out3 R=X
D25 N058 N057 1N5818
R50 COM N058 R=Y
Q26 out_multi N007 0 0 BC547B
R51 COM out_multi R=X
D26 N007 in 1N5818
R52 COM N007 R=Y
Q27 out_multi2 N005 0 0 BC547B
R53 COM out_multi2 R=X
D27 N005 out_multi 1N5818
R54 COM N005 R=Y
Q28 out_multi2 N008 0 0 BC547B
R55 COM out_multi2 R=X
D28 N008 out_multi 1N5818
R56 COM N008 R=Y
Q29 out_multi2 N006 0 0 BC547B
R57 COM out_multi2 R=X
D29 N006 out_multi 1N5818
R58 COM N006 R=Y
Q30 out_multi2 N009 0 0 BC547B
R59 COM out_multi2 R=X
D30 N009 out_multi 1N5818
R60 COM N009 R=Y
Q31 out_multi2 N001 0 0 BC547B
R61 COM out_multi2 R=X
D31 N001 out_multi 1N5818
R62 COM N001 R=Y
Q32 out_multi2 N003 0 0 BC547B
R63 COM out_multi2 R=X
D32 N003 out_multi 1N5818
R64 COM N003 R=Y
Q33 out_multi2 N002 0 0 BC547B
R65 COM out_multi2 R=X
D33 N002 out_multi 1N5818
R66 COM N002 R=Y
Q34 out_multi2 N004 0 0 BC547B
R67 COM out_multi2 R=X
D34 N004 out_multi 1N5818
R68 COM N004 R=Y
Q35 out_single_x N010 0 0 BC547B
R69 COM out_single_x R=X
D35 N010 in 1N5818
R70 COM N010 R=Y
Q36 out_single_y N011 0 0 BC547B
R71 COM out_single_y R=X
D36 N011 out_single_x 1N5818
R72 COM N011 R=Y
V3 N013 0 PULSE(0 5 0 100u 100u 100u 400u)
.model D D
.lib standard.dio
.model NPN NPN
.model PNP PNP
.lib standard.bjt
.tran 0 2u 1u 1e-8
.param X=4.7k Y=4.7k
.backanno
.end